# Altium schematic sheet Main 12ch.SchDoc
size A4
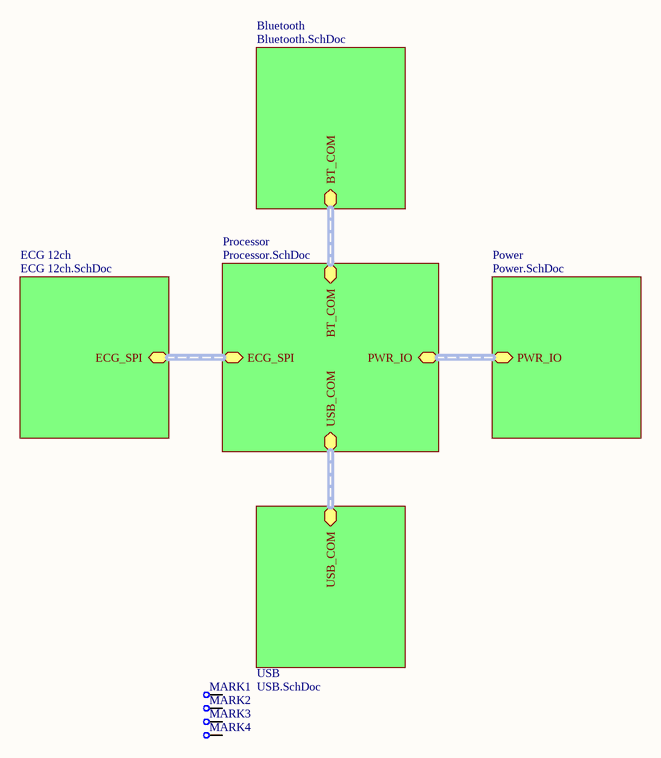
[diagram p0: Main 12ch.SchDoc]

## Parts
MARK1  (no value)  [1MM MARK]
MARK2  (no value)  [1MM MARK]
MARK3  (no value)  [1MM MARK]
MARK4  (no value)  [1MM MARK]

## Sub-sheets
Bluetooth = Bluetooth.SchDoc: BT_COM (harness BT_COM)
ECG 12ch = ECG 12ch.SchDoc: ECG_SPI (harness ECG_SPI)
Power = Power.SchDoc: PWR_IO (harness PWR_IO)
Processor = Processor.SchDoc: ECG_SPI (harness ECG_SPI), BT_COM (harness BT_COM), USB_COM (harness USB_COM), PWR_IO (harness PWR_IO)
USB = USB.SchDoc: USB_COM (harness USB_COM)

## Nets

Not connected (* = marked no-connect by the designer): MARK1 1; MARK2 1; MARK3 1; MARK4 1

## Buses and harness runs
harness sheet Bluetooth/BT_COM = sheet Processor/BT_COM
harness sheet ECG 12ch/ECG_SPI = sheet Processor/ECG_SPI
harness sheet Power/PWR_IO = sheet Processor/PWR_IO
harness sheet Processor/USB_COM = sheet USB/USB_COM

## Library data of the parts
MARK1-MARK4 = TP